# Altium schematic sheet DE22.SchDoc
size A4; SheetNumber: 1; SheetTotal: 1; SPICEModelCacheZZRKWTNW: <root> / <DocumentId>ZZRKWTNW</DocumentId> / <CacheFrame Number="0"> / <Model Name="1n4007" Kind="MDL"> / <Text>*1N4007 MCE 8-16-95 / *1000V 1A Si GenPurpose Diode pkg:DIODE0.4 1,2 / .MODEL 1N4007 D(IS=2.55E-9 RS=0.042 N=1.75 TT=5.76E-6 CJO=1.85E-11 / + VJ=0.75 M=0.333 BV=1000 IBV=9.86E-5 )</Text> / </Model> / <Model Name="led2" Kind="MDL"> / <Text>*Typ RED,GREEN,YELLOW,AMBER GaAs LED: Vf=2.1V Vr=4V If=40mA trr=3uS / *LED Pinout: 1=A, 2=K / .MODEL LED2 D (IS=93.1P RS=42M N=4.61 BV=4 IBV=10U / + CJO=2.97P VJ=.75 M=.333 TT=4.32U)</Text> / </Model> / <Model Name="spdtrelay" Kind="CKT"> / <Text>*Generic SPDT Relay / *Connections:     COM / *                 | NC / *                 | | NO / *                 | | | T1 / *                 | | | | T2 / *                 | | | | | / .SUBCKT SPDTRELAY 1 2 3 4 5 / + PARAMS: PULLIN=4 DROPOFF=0.1 CONTACT=1m RESISTANCE=500 INDUCTANCE=10m / L1 4 6 {(INDUCTANCE/2)} / L2 5 7 {(INDUCTANCE/2)} / R1 6 7 {RESISTANCE} / BNO 8 0 V={PULLIN}-abs(v(6,7)) / SW1 2 1 8 0 SWNC ON / BNC 9 0 V=abs(v(6,7)) / SW2 3 1 9 0 SWNO OFF / .MODEL SWNC SW(VT={DROPOFF} RON={CONTACT} ) / .MODEL SWNO SW(VT={(PULLIN*0.98)} RON={CONTACT} ) / .ENDS SPDTRELAY</Text> / </Model> / <Model Name="2n3904" Kind="MDL"> / <Text>*2N3904 / *Si 310mW  40V 200mA 300MHz pkg:TO-92B 1,2,3 / .MODEL 2N3904 NPN(IS=1.4E-14 BF=300 VAF=100 IKF=0.025 ISE=3E-13 / + BR=7.5 RC=2.4 CJE=4.5E-12 TF=4E-10 CJC=3.5E-12 TR=2.1E-8 XTB=1.5 KF=9E-16 )</Text> / </Model> / </CacheFrame> / </root>
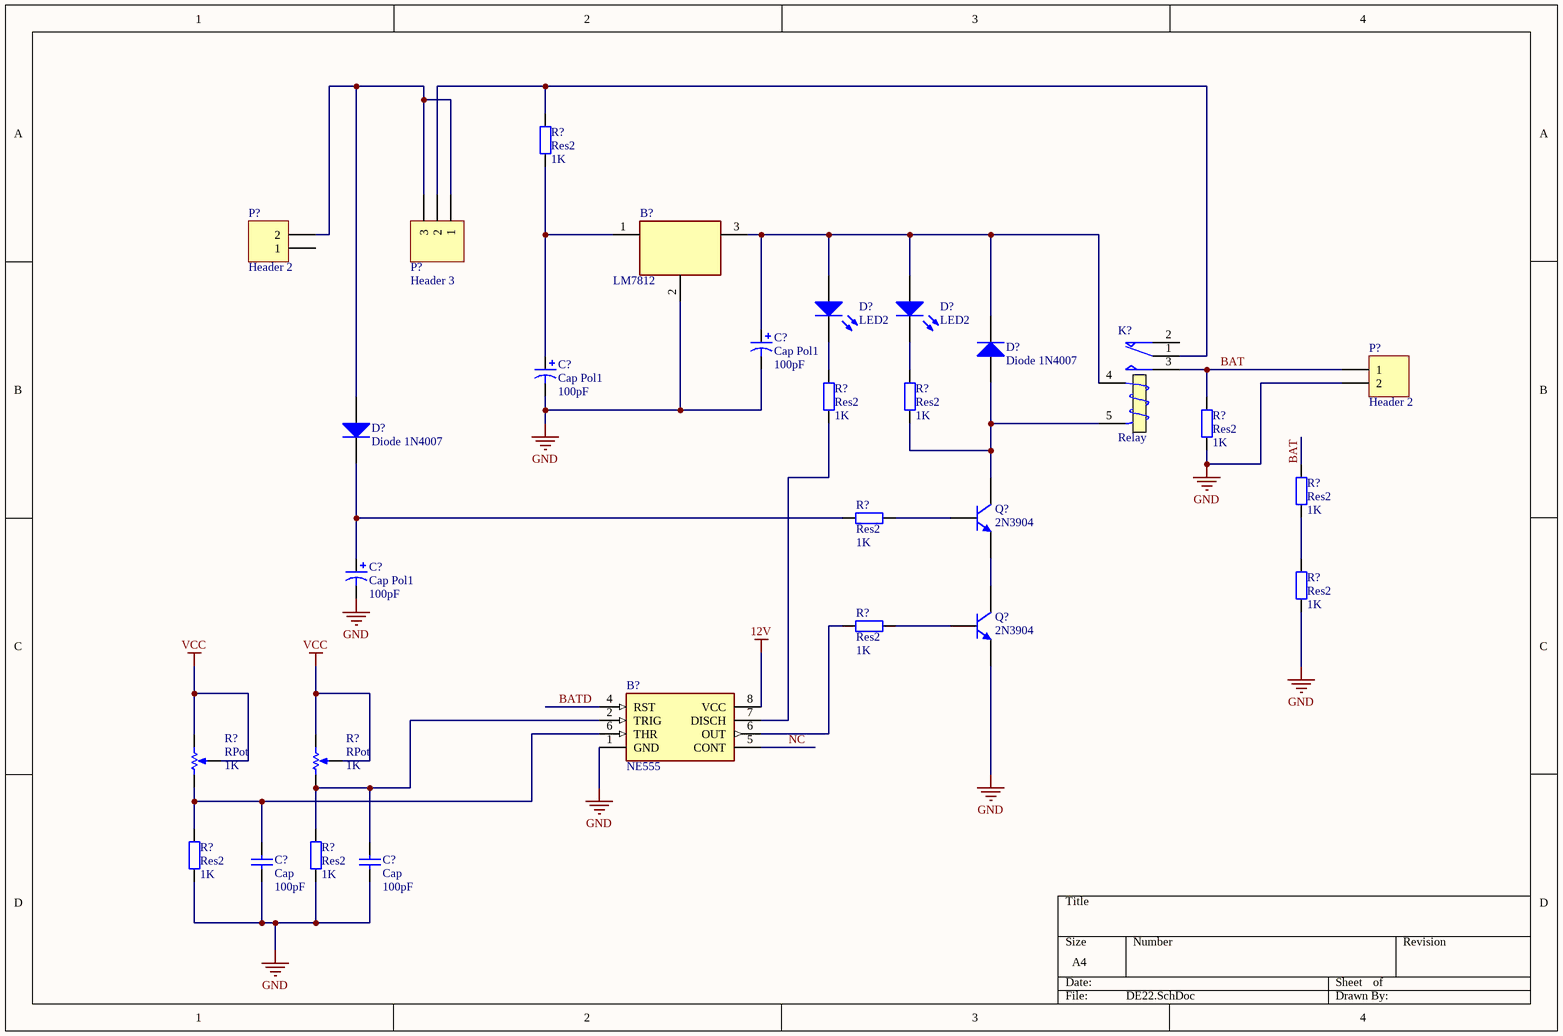
[diagram p0: DE22.SchDoc]

## Parts
(Parts that share a designator on the sheet are numbered #1, #2 ... from top to bottom, then left to right.)
B?#1  LM7812  [TO254P470X1028X1955-3P]
B?#2  NE555  [SOIC127P600X175-8N]
C?#1  Cap Pol1  value 100pF  [RB7.6-15]
C?#2  Cap Pol1  value 100pF  [RB7.6-15]
C?#3  Cap Pol1  value 100pF  [RB7.6-15]
C?#4  Cap  value 100pF  [RAD-0.3]
C?#5  Cap  value 100pF  [RAD-0.3]
D?#1  LED2  [3.2X1.6X1.1]
D?#2  LED2  [3.2X1.6X1.1]
D?#3  Diode 1N4007  [DO-41]
D?#4  Diode 1N4007  [DO-41]
K?  Relay  [MODULE5B]
P?#1  Header 3  [HDR1X3]
P?#2  Header 2  [HDR1X2]
P?#3  Header 2  [HDR1X2]
Q?#1  2N3904  [TO-92A]
Q?#2  2N3904  [TO-92A]
R?#1  Res2  value 1K  [AXIAL-0.4]
R?#2  Res2  value 1K  [AXIAL-0.4]
R?#3  Res2  value 1K  [AXIAL-0.4]
R?#4  Res2  value 1K  [AXIAL-0.4]
R?#5  Res2  value 1K  [AXIAL-0.4]
R?#6  Res2  value 1K  [AXIAL-0.4]
R?#7  Res2  value 1K  [AXIAL-0.4]
R?#8  Res2  value 1K  [AXIAL-0.4]
R?#9  RPot  value 1K  [VR5]
R?#10  RPot  value 1K  [VR5]
R?#11  Res2  value 1K  [AXIAL-0.4]
R?#12  Res2  value 1K  [AXIAL-0.4]

## Nets
12V: B?#2.8(VCC)
GND: B?#1.2(GND) B?#2.1(GND) C?#1.2 C?#2.2 C?#3.2 C?#4.1 C?#5.1 P?#3.2 Q?#2.1(E) R?#4.1 R?#7.1 R?#11.1 R?#12.1
VCC: R?#9.2(BOT) R?#9.3(TAP) R?#10.2(BOT) R?#10.3(TAP)
BAT: K?.3(NO) P?#3.1 R?#4.2 R?#6.2
BATD: B?#2.4(RST)
NC: B?#2.5(CONT)
NetB?#1_1: B?#1.1(INPUT) C?#2.1 R?#1.1
NetB?#1_3: B?#1.3(OUTPUT) C?#1.1 D?#1.1(A) D?#2.1(A) D?#3.2(K) K?.4(T1)
NetB?#2_2: B?#2.2(TRIG) C?#5.2 R?#10.1(TOP) R?#12.2
NetB?#2_6: B?#2.6(OUT) R?#8.1
NetB?#2_6: B?#2.6(THR) C?#4.2 R?#9.1(TOP) R?#11.2  [a separate net that carries the same name]
NetB?#2_7: B?#2.7(DISCH) R?#2.1
NetC?#3_1: C?#3.1 D?#4.2(K) R?#5.1
NetD?#1_2: D?#1.2(K) R?#2.2
NetD?#2_2: D?#2.2(K) R?#3.2
NetD?#3_1: D?#3.1(A) K?.5(T2) Q?#1.3(C) R?#3.1
NetD?#4_1: D?#4.1(A) P?#1.1 P?#1.3 P?#2.2
NetK?_1: K?.1(COM) P?#1.2 R?#1.2
NetQ?#1_1: Q?#1.1(E) Q?#2.3(C)
NetQ?#1_2: Q?#1.2(B) R?#5.2
NetQ?#2_2: Q?#2.2(B) R?#8.2
NetR?#6_1: R?#6.1 R?#7.2

Not connected (* = marked no-connect by the designer): K? 2(NC); P?#2 1

## Library data of the parts
B?#1 = LM7812CT: TO220 voltage regulator,LM7812CT 12V 1A; Manufacturer_Name: Texas Instruments; Geometry.Height: 4.7mm; Manufacturer_Part_Number: LM7812CT; Mouser Part Number: 926-LM7812CT; Mouser Price/Stock: https://www.mouser.co.uk/ProductDetail/Texas-Instruments/LM7812CT?qs=QbsRYf82W3EQj7KGft8TFg%3D%3D; Arrow Part Number: *; Arrow Price/Stock: *; Datasheet Link: http://www.ti.com/lit/ds/symlink/lm7800.pdf
B?#2 = NE555: Timers & Support Products; Manufacturer_Name: Diodes Incorporated; Geometry.Height: 1.75mm; Manufacturer_Part_Number: NE555; Mouser Part Number: N/A; Mouser Price/Stock: https://www.mouser.co.uk/ProductDetail/Diodes-Incorporated/NE555?qs=Wj%2FVkw3K%252BMDvMoYkR61Dtg%3D%3D; Arrow Part Number: *; Arrow Price/Stock: *; Datasheet Link: https://www.datasheet.com/bav99.pdf
C?#1-C?#3 = Cap Pol1: Polarized Capacitor (Radial); Published: 8-Jun-2000; LatestRevisionDate: 17-Jul-2002; LatestRevisionNote: Re-released for DXP Platform.; PackageReference: RB7.6-15; Publisher: Altium Limited; PackageDescription: Polarized Capacitor (Radial); 2 Leads
C?#4 C?#5 = Cap: Capacitor; Published: 8-Jun-2000; LatestRevisionDate: 17-Jul-2002; LatestRevisionNote: Re-released for DXP Platform.; PackageReference: RAD-0.3; Publisher: Altium Limited; PackageDescription: Radial Cap, Thru-Hole; 2 Leads; 0.3 in Pin Spacing
D?#1 D?#2 = LED2: Typical RED, GREEN, YELLOW, AMBER GaAs LED; Published: 8-Jun-2000; LatestRevisionDate: 17-Jul-2002; LatestRevisionNote: Re-released for DXP Platform.; PackageVersion: Feb-2002; PackageReference: 3.2X1.6X1.1; Publisher: Altium Limited; PackageDescription: SM LED; 2 Flat Leads
D?#3 D?#4 = Diode 1N4007: 1 Amp General Purpose Rectifier; Published: 8-Jun-2000; LatestRevisionDate: 17-Jul-2002; LatestRevisionNote: Re-released for DXP Platform.; DatasheetVersion: 1998; PackageVersion: Aug-1999; PackageReference: DO-41; Publisher: Altium Limited; PackageDescription: Diode, Axial; Body 5.2 x 2.7 mm (LxDia. max), Lead Dia. 0.86 mm (max); Code_JEDEC: DO-204-AL; ComponentLink1Description: Manufacturer Link; ComponentLink1URL: http://www.fairchildsemi.com/; ComponentLink2Description: Datasheet; ComponentLink2URL: http://www.fairchildsemi.com/ds/1N%2F1N4001.pdf
K? = Relay: SPDT Relay; Published: 8-Jun-2000; LatestRevisionDate: 17-Jul-2002; LatestRevisionNote: Re-released for DXP Platform.; PackageReference: MODULE5B; Publisher: Altium Limited
P?#1 = Header 3: Header, 3-Pin; LatestRevisionDate: 17-Jul-2002; LatestRevisionNote: Re-released for DXP Platform.; Publisher: Altium Limited
P?#2 P?#3 = Header 2: Header, 2-Pin; LatestRevisionDate: 17-Jul-2002; LatestRevisionNote: Re-released for DXP Platform.; Publisher: Altium Limited
Q?#1 Q?#2 = 2N3904: NPN General Purpose Amplifier; Published: 8-Jun-2000; LatestRevisionDate: 15-Jan-2003; LatestRevisionNote: PCB Footprint 'BCY-W3/D4.7' replaced; DatasheetVersion: 1997; PackageVersion: Sep-1998; PackageReference: TO-92A; Publisher: Altium Limited; PackageDescription: TO, Flat Index; 3 In-Line, Axial Leads; Body Dia. 4.5mm; Leads 0.51 x 0.48 mm (max); ComponentLink1Description: Manufacturer Link; ComponentLink1URL: http://www.fairchildsemi.com/; ComponentLink2Description: Datasheet; ComponentLink2URL: http://www.fairchildsemi.com/ds/2N%2F2N3904.pdf
R?#1-R?#8 R?#11 R?#12 = Res2: Resistor; Published: 8-Jun-2000; LatestRevisionDate: 17-Jul-2002; LatestRevisionNote: Re-released for DXP Platform.; PackageReference: AXIAL-0.4; Publisher: Altium Limited; PackageDescription: Axial Device, Thru-Hole; 2 Leads; 0.4 in Pin Spacing
R?#9 R?#10 = RPot: Potentiometer; Sim Note: Enter the Resistance value and the set point into parameter fields.; Set Position: 0.5; Published: 8-Jun-2000; LatestRevisionDate: 17-Jul-2002; LatestRevisionNote: Re-released for DXP Platform.; PackageReference: VR5; Publisher: Altium Limited; PackageDescription: Variable Resistor, Thru-Hole; 3 Leads